# EAGLE design I2C2_6_0 (EAGLE 6.1)
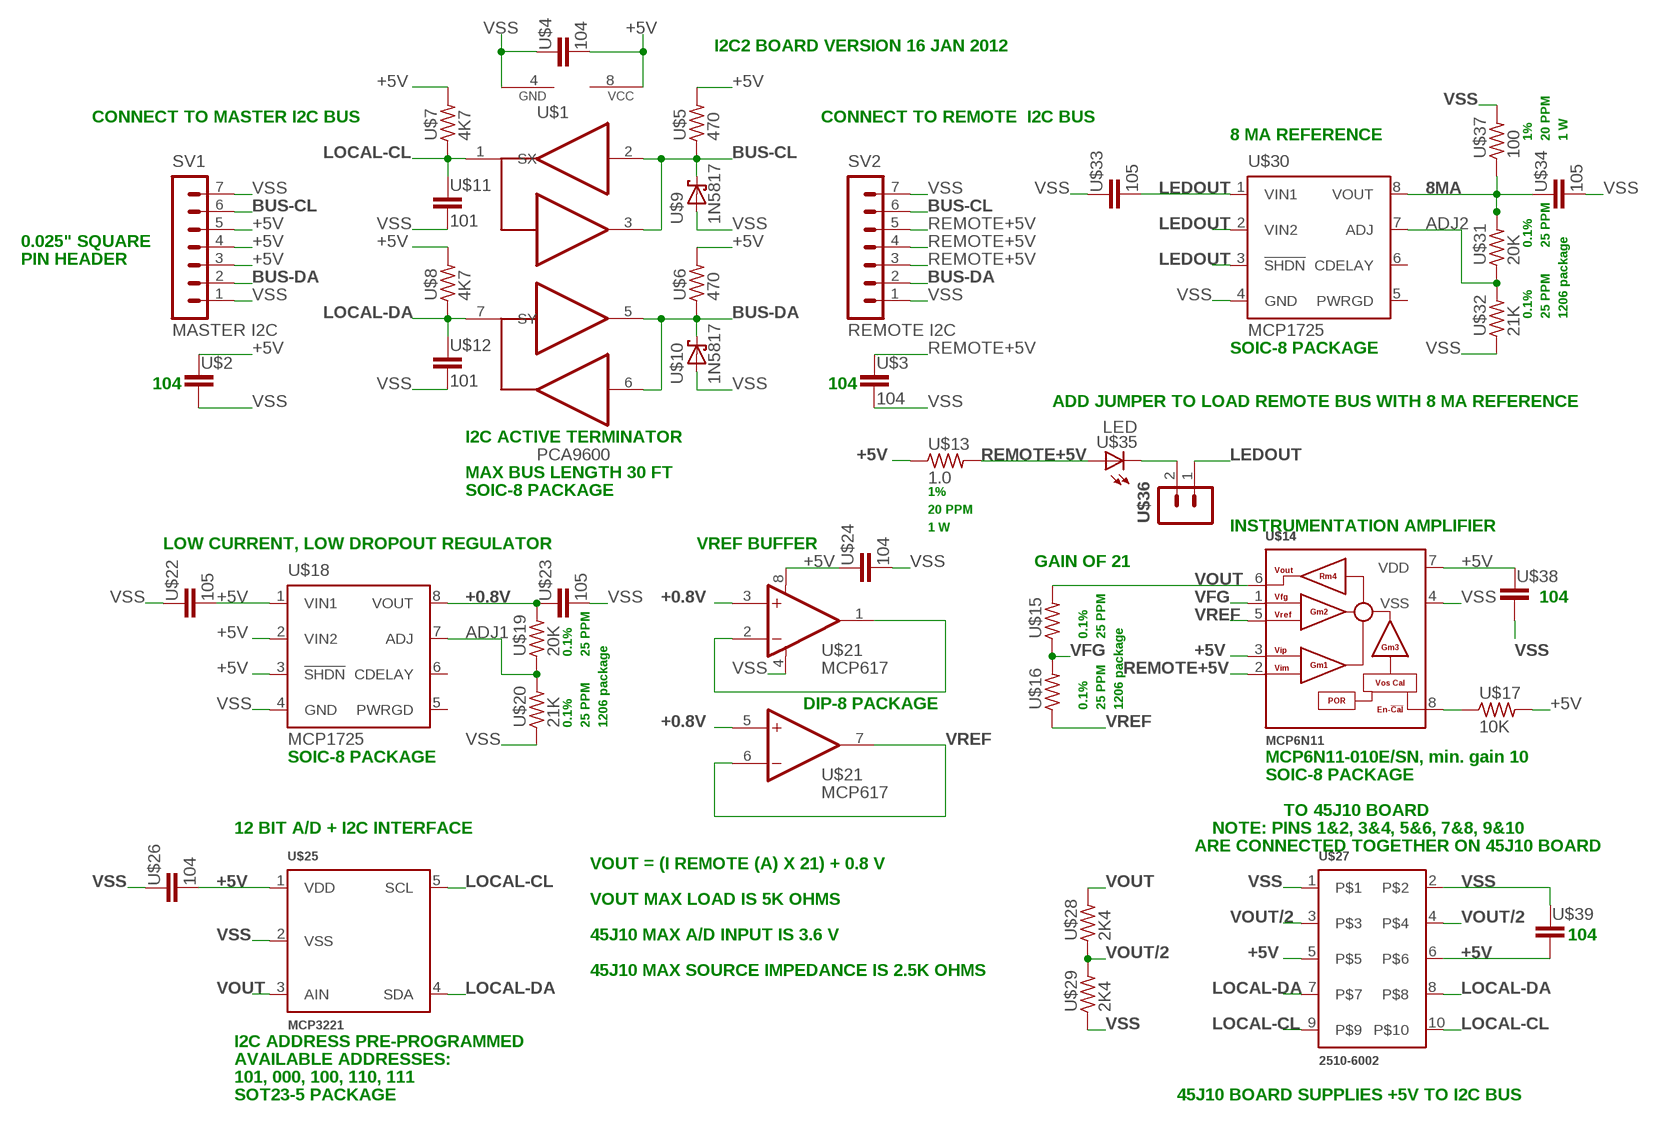
[diagram p0: schematic, sheet 1]

## Parts
SV1  MASTER I2C  MA07-1  [MA07-1]
SV2  REMOTE I2C  MA07-1  [MA07-1]
U$1  PCA9600  PCA9600SO8  [SO08]
U$2  C2.5-5  [C2.5-5]
U$3  104  C2.5-5  [C2.5-5]
U$4  104  C2.5-5  [C2.5-5]
U$5  470  R-1/4W  [R-1/4W]
U$6  470  R-1/4W  [R-1/4W]
U$7  4K7  R-1/4W  [R-1/4W]
U$8  4K7  R-1/4W  [R-1/4W]
U$9  1N5817  1N5817P  [1N5817]
U$10  1N5817  1N5817P  [1N5817]
U$11  101  C2.5-5  [C2.5-5]
U$12  101  C2.5-5  [C2.5-5]
U$13  1.0  R-1W-20PPM  [R-1W]
U$14  MCP6N11  MCP6N11-SO08  [SO08]
U$15  R1206  [R1206]
U$16  R1206  [R1206]
U$17  10K  R-1/4W  [R-1/4W]
U$18  MCP1725  MCP1725-ADJ  [SO08]
U$19  20K  R1206  [R1206]
U$20  21K  R1206  [R1206]
U$21  MCP617  MCP617-I/P  [DIL08]
U$22  105  C2.5-5  [C2.5-5]
U$23  105  C2.5-5  [C2.5-5]
U$24  104  C2.5-5  [C2.5-5]
U$25  MCP3221  [SOT23-5]
U$26  104  C2.5-5  [C2.5-5]
U$27  2510-6002  [2510-6002]
U$28  2K4  R-1/4W  [R-1/4W]
U$29  2K4  R-1/4W  [R-1/4W]
U$30  MCP1725  MCP1725-ADJ  [SO08]
U$31  20K  R1206  [R1206]
U$32  21K  R1206  [R1206]
U$33  105  C2.5-5  [C2.5-5]
U$34  105  C2.5-5  [C2.5-5]
U$35  LED  LED-SMD-1206  [LED1206]
U$36  MA02-1  [MA02-1]
U$37  100  R-1W-20PPM  [R-1W]
U$38  C2.5-5  [C2.5-5]
U$39  C2.5-5  [C2.5-5]

## Nets
8MA: U$30.8(VOUT) U$31.2 U$34.1 U$37.1
+0.8V: U$18.8(VOUT) U$19.2 U$21.3(+IN) U$21.5(+IN1) U$23.1
+5V: SV1.3 SV1.4 SV1.5 U$1.8(VCC) U$2.1 U$4.2 U$5.2 U$6.2 U$7.2 U$8.2 U$13.1 U$14.3(VIP) U$14.7(VDD) U$17.2 U$18.1(VIN1) U$18.2(VIN2) U$18.3(!SHDN) U$21.8(V+) U$22.2 U$24.1 U$25.1(VDD) U$26.2 U$27.5 U$27.6 U$38.1 U$39.2
ADJ1: U$18.7(ADJ) U$19.1 U$20.2
ADJ2: U$30.7(ADJ) U$31.1 U$32.2
BUS-CL: SV1.6 SV2.6 U$1.2(RX) U$1.3(TX) U$5.1 U$9.C
BUS-DA: SV1.2 SV2.2 U$1.5(TY) U$1.6(RY) U$6.1 U$10.C
LEDOUT: U$30.1(VIN1) U$30.2(VIN2) U$30.3(!SHDN) U$33.2 U$36.1
LOCAL-CL: U$1.1(SX) U$7.1 U$11.1 U$25.5(SCL) U$27.9 U$27.10
LOCAL-DA: U$1.7(SY) U$8.1 U$12.1 U$25.4(SDA) U$27.7 U$27.8
N$1: U$35.C U$36.2
N$3: U$14.8(EN) U$17.1
REMOTE+5V: SV2.3 SV2.4 SV2.5 U$3.1 U$13.2 U$14.2(VIM) U$35.A
VFG: U$14.1(VFG) U$15.1 U$16.2
VOUT: U$14.6(VOUT) U$15.2 U$25.3(AIN) U$28.2
VOUT/2: U$27.3 U$27.4 U$28.1 U$29.2
VREF: U$14.5(VREF) U$16.1 U$21.6(-IN1) U$21.7(OUT1)
VREF2: U$21.1(OUT) U$21.2(-IN)
VSS: SV1.1 SV1.7 SV2.1 SV2.7 U$1.4(GND) U$2.2 U$3.2 U$4.1 U$9.A U$10.A U$11.2 U$12.2 U$14.4(VSS) U$18.4(GND) U$20.1 U$21.4(V-) U$22.1 U$23.2 U$24.2 U$25.2(VSS) U$26.1 U$27.1 U$27.2 U$29.1 U$30.4(GND) U$32.1 U$33.1 U$34.2 U$37.2 U$38.2 U$39.1
Unconnected: U$18.5(PWRGD) U$18.6(CDELAY) U$30.5(PWRGD) U$30.6(CDELAY)

## Notes on the sheet
- I2C2 BOARD VERSION 16 JAN 2012
- CONNECT TO MASTER I2C BUS | CONNECT TO REMOTE  I2C BUS
- 8 MA REFERENCE | 1% | 20 PPM | 1 W
- 0.025" SQUARE | 0.1% | 25 PPM
- PIN HEADER
- 0.1% | 25 PPM | 1206 package
- SOIC-8 PACKAGE
- 104 | 104
- ADD JUMPER TO LOAD REMOTE BUS WITH 8 MA REFERENCE
- I2C ACTIVE TERMINATOR
- MAX BUS LENGTH 30 FT
- SOIC-8 PACKAGE | 1%
- 20 PPM
- 1 W | INSTRUMENTATION AMPLIFIER
- LOW CURRENT, LOW DROPOUT REGULATOR | VREF BUFFER
- GAIN OF 21
- 104
- 0.1% | 25 PPM
- 0.1% | 25 PPM
- DIP-8 PACKAGE | 0.1% | 25 PPM | 1206 package
- 0.1% | 25 PPM | 1206 package
- SOIC-8 PACKAGE | MCP6N11-010E/SN, min. gain 10
- SOIC-8 PACKAGE
- TO 45J10 BOARD
- 12 BIT A/D + I2C INTERFACE | NOTE: PINS 1&2, 3&4, 5&6, 7&8, 9&10
- ARE CONNECTED TOGETHER ON 45J10 BOARD
- VOUT = (I REMOTE (A) X 21) + 0.8 V
- VOUT MAX LOAD IS 5K OHMS
- 45J10 MAX A/D INPUT IS 3.6 V | 104
- 45J10 MAX SOURCE IMPEDANCE IS 2.5K OHMS
- I2C ADDRESS PRE-PROGRAMMED
- AVAILABLE ADDRESSES:
- 101, 000, 100, 110, 111
- SOT23-5 PACKAGE | 45J10 BOARD SUPPLIES +5V TO I2C BUS

## Library data of the parts
SV1 SV2 = 4534_I2C2:MA07-1: Male Header 0.040 drill
U$1 = 4534_I2C2:PCA9600: I2C ACTIVE TERMINATOR SO-8
U$2-U$4 U$11 U$12 U$22-U$24 U$26 U$33 U$34 U$38 U$39 = 4534_I2C2:C2.5-5: CAPACITOR, 2.5 MM SPACING
U$5-U$8 U$17 U$28 U$29 = 4534_I2C2:R-1/4W: STANDARD 1/4W 5% RESISTOR
U$9 U$10 = 4534_I2C2:1N5817: Schottky diode
U$13 U$37 = 4534_I2C2:R-1W: Ohmite WNB 1% 1 W resistor
U$14 = 4534_I2C2:MCP6N11: 500 kHz, 800 µA Instrumentation Amplifier
U$15 U$16 U$19 U$20 U$31 U$32 = 4534_I2C2:R1206: Surface mount resistor, 1206 package
U$18 U$30 = 4534_I2C2:MCP1725: 500 mA, Low Voltage, Low Quiescent Current LDO Regulator
U$21 = 4534_I2C2:MCP617: Microchip dual opamp
U$25 = 4534_I2C2:MCP3221: Low Power 12-Bit A/D Converter With I2C Interface
U$27 = 4534_I2C2:2510-6002: 3M 2510-6002 Walled Header
U$35 = 4534_I2C2:LED-SMD-1206: 160-1169-1-ND
U$36 = 4534_I2C2:MA02-1: Male Header 0.040 drill

## Board
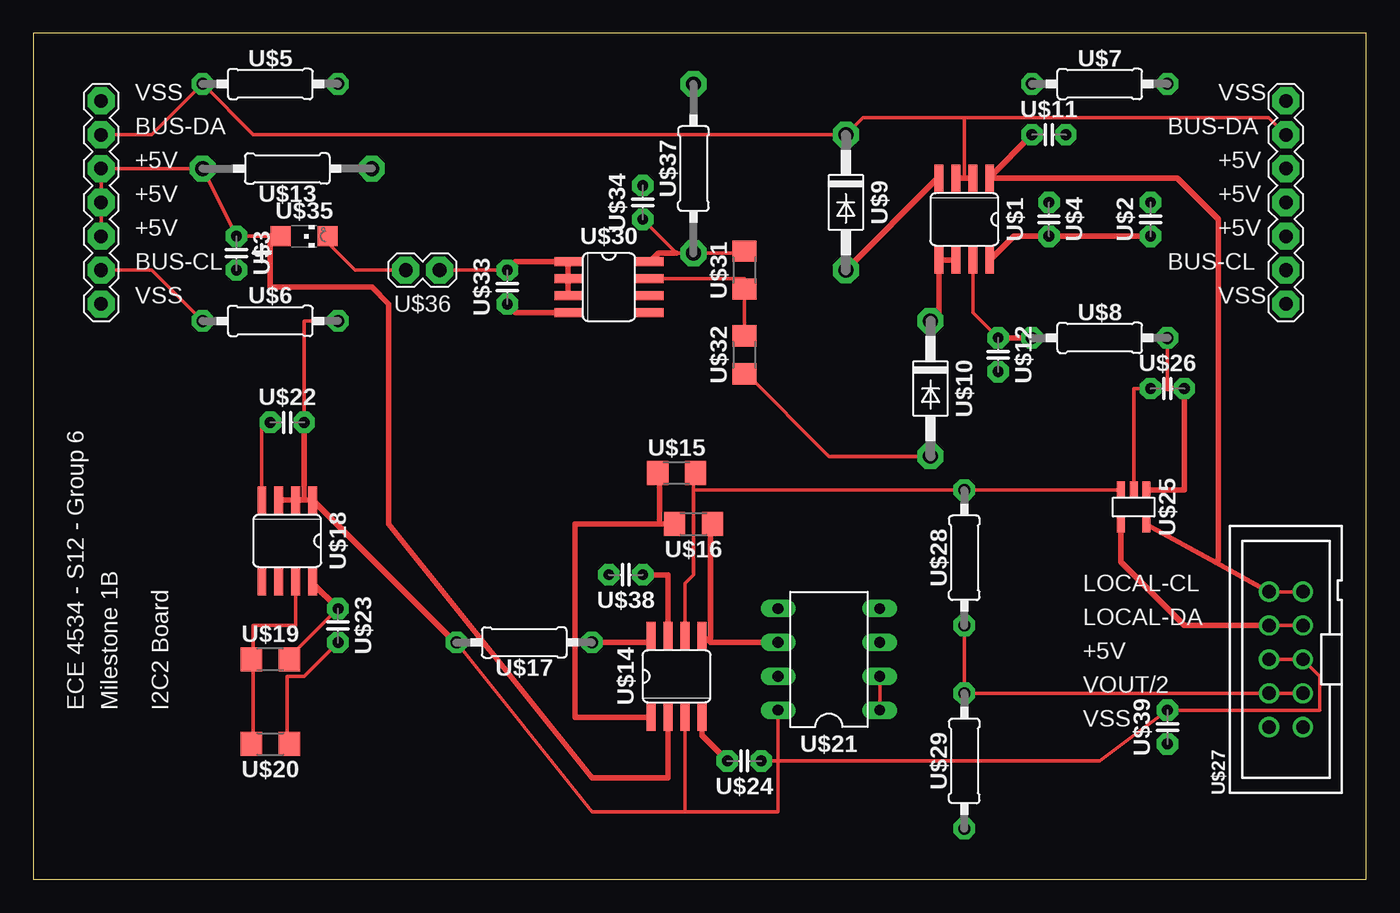
[diagram p1: board, top side]
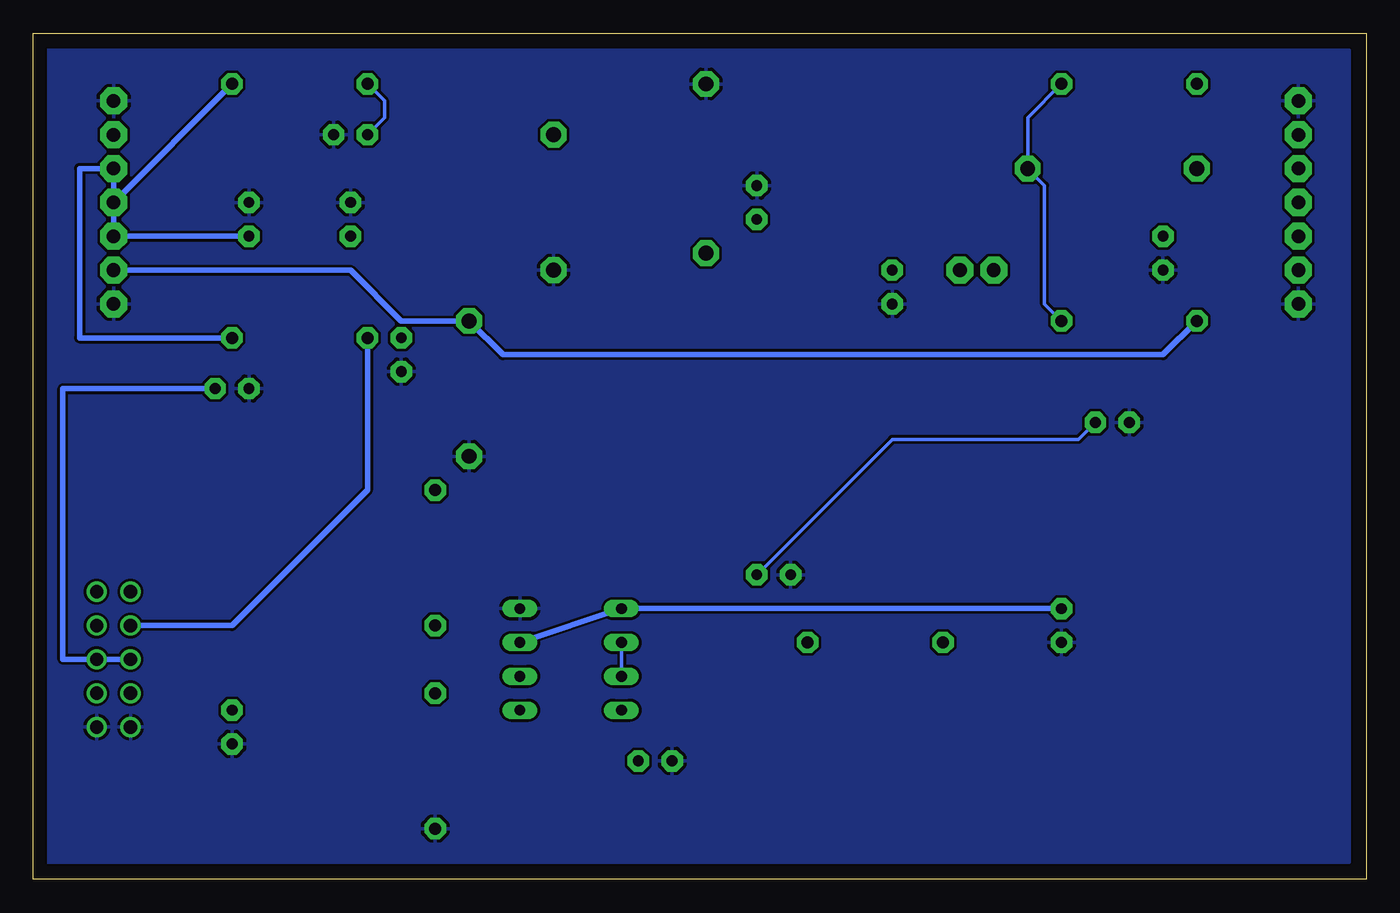
[diagram p2: board, bottom side, seen from below]

Size 100 x 63.49 mm. Coordinates in mm from the lower left corner, seen from the top.
Outline: 0,0 100,0 100,63.49 0,63.49 0,0
Copper layers (1*16): Top 0.035mm / dielectric 1.5mm / Bottom 0.035mm
Design rules: minimum track width 10mil, minimum drill 24mil, track to track 8mil, track to pad 8mil, pad to pad 8mil, via to via 8mil, smd to smd 8mil, copper to edge 40mil, drill to drill 8mil, minimum pad ring 10mil, minimum via ring 8mil, stop-mask expansion 4mil, vias tented up to drill 0mil, thermal gap 10mil
tRestrict: area 41.9,41.9 to 44.5,47; area 67.3,48.3 to 72.4,50.8; area 58.4,11.4 to 61,21.6; area 45.7,14 to 50.8,16.5; area 16.5,24.1 to 21.6,26.7

### Footprints (pad centres in the part's own frame; a part is rotated, then mirrored left to right if it is on the bottom)
MA07-1 = drill 1.016 pad 2.032 octagon: 1 -7.62,0; 2 -5.08,0; 3 -2.54,0; 4 0,0; 5 2.54,0; 6 5.08,0; 7 7.62,0
SO08 = smd 0.66 x 2.032: 1 -1.905,-3.073; 2 -0.635,-3.073; 3 0.635,-3.073; 4 1.905,-3.073; 5 1.905,3.073; 6 0.635,3.073; 7 -0.635,3.073; 8 -1.905,3.073
C2.5-5 = drill 0.813 pad 1.6 octagon: 1 -1.27,0; 2 1.27,0
R-1/4W = drill 0.9 pad 1.6 octagon: 1 -5.08,0; 2 5.08,0
1N5817 = drill 1.118 pad 1.93 octagon: A 5.08,0; C -5.08,0
R-1W = drill 1.118 pad 1.93 octagon: 1 -6.35,0; 2 6.35,0
R1206 = smd 1.6 x 1.803: 1 -1.422,0; 2 1.422,0
DIL08 = drill 0.813 long: 1 -3.81,-3.81; 2 -1.27,-3.81; 3 1.27,-3.81; 4 3.81,-3.81; 5 3.81,3.81; 6 1.27,3.81; 7 -1.27,3.81; 8 -3.81,3.81
SOT23-5 = smd 0.6 x 1.2: 1 -0.95,-1.306; 2 0,-1.306; 3 0.95,-1.306; 4 0.95,1.306; 5 -0.95,1.306
2510-6002 = drill 1 pad 1.422: 1 -5.08,-1.27; 2 -5.08,1.27; 3 -2.54,-1.27; 4 -2.54,1.27; 5 0,-1.27; 6 0,1.27; 7 2.54,-1.27; 8 2.54,1.27; 9 5.08,-1.27; 10 5.08,1.27
LED1206 = smd 1.5 x 1.5: A 0,-1.75; C 0,1.75
MA02-1 = drill 1.016 pad 2.032 octagon: 1 -1.27,0; 2 1.27,0

### Placement (x,y rotation side)
SV1  93.98,50.8 90 top
SV2  5.08,50.8 90 top
U$1  69.85,49.53 180 top
U$2  83.82,49.53 90 top
U$3  15.24,46.99 270 top
U$4  76.2,49.53 270 top
U$5  17.78,59.69 0 top
U$6  17.78,41.91 0 top
U$7  80.01,59.69 0 top
U$8  80.01,40.64 0 top
U$9  60.96,50.8 270 top
U$10  67.31,36.83 270 top
U$11  76.2,55.88 0 top
U$12  72.39,39.37 270 top
U$13  19.05,53.34 180 top
U$14  48.26,15.24 0 top
U$15  48.26,30.48 0 top
U$16  49.53,26.67 180 top
U$17  36.83,17.78 180 top
U$18  19.05,25.4 180 top
U$19  17.78,16.51 0 top
U$20  17.78,10.16 180 top
U$21  59.69,16.51 90 top
U$22  19.05,34.29 0 top
U$23  22.86,19.05 270 top
U$24  53.34,8.89 180 top
U$25  82.55,27.94 180 top
U$26  85.09,36.83 0 top
U$27  93.98,16.51 90 top
U$28  69.85,24.13 90 top
U$29  69.85,8.89 90 top
U$30  43.18,44.45 270 top
U$31  53.34,45.72 90 top
U$32  53.34,39.37 90 top
U$33  35.56,44.45 90 top
U$34  45.72,50.8 90 top
U$35  20.32,48.26 270 top
U$36  29.21,45.72 180 top
U$37  49.53,53.34 90 top
U$38  44.45,22.86 180 top
U$39  85.09,11.43 90 top

### Tracks (layer width: path | path; a pad name or v marks a point on that pad's centre or on a via)
8MA
  Top 0.254: U$31.2 53.34,46.99 U$37.1 48.26,46.99 U$34.1
  Top 0.406: 48.26,46.99 46.89,46.99 U$30.8
+0.8V
  Top 0.254: U$23.1 19.05,16.51 U$19.2
  Top 0.406: U$18.8 20.95,22.22 U$23.1
  Bottom 0.406: U$23.1 U$21.5 U$21.3
+5V
  Top 0.254: U$27.6 U$27.5 96.52,15.24 96.52,12.7 U$39.2 80.01,8.89 55.88,8.89 | 55.88,8.89 55.88,5.08 48.9,5.08 | 55.88,8.89 U$21.8 | U$24.1 55.88,8.89 | U$17.2 41.91,5.08 48.9,5.08 | 85.09,36.83 U$8.2 | U$22.2 20.32,41.91 U$6.2 | U$14.3 48.9,5.08
  Top 0.406: 85.09,36.83 U$26.2 86.36,29.21 83.5,29.21 U$25.1 | U$18.3 U$18.2 U$18.1 | U$18.1 20.32,28.47 U$22.2 | U$1.8 73.56,48.26 U$4.2 U$2.1 | U$17.2 31.65,17.78 U$18.1 | U$38.1 47.62,22.86 U$14.7
  Bottom 0.254: U$5.2 25.4,57.15 U$13.1 24.13,52.07 24.13,43.18 U$6.2 | U$38.1 35.56,33.02 21.59,33.02 U$22.2
  Bottom 0.406: U$7.2 SV1.4 | U$8.2 96.52,40.64 96.52,53.34 SV1.5 SV1.4 | SV1.4 SV1.3 U$2.1 | U$27.6 97.79,16.51 97.79,36.83 U$26.2
ADJ1
  Top 0.254: 16.51,16.51 16.51,10.16 U$20.2 | 16.51,16.51 U$19.1 | U$18.7 19.68,19.05 16.51,19.05 16.51,16.51
ADJ2
  Top 0.254: 53.34,40.64 U$32.2 U$31.1 53.34,45.08 U$30.7
BUS-CL
  Top 0.254: SV2.6 8.89,55.88 U$5.1 16.51,55.88 U$9.C 62.23,57.15 69.85,57.15 | 69.85,57.15 92.71,57.15 SV1.6 | U$1.3 69.85,52.6 69.85,57.15
  Top 0.406: U$1.2 U$1.3
BUS-DA
  Top 0.254: U$6.1 8.89,45.72 SV2.2
  Top 0.406: U$1.6 U$1.5 67.94,42.55 U$10.C
  Bottom 0.406: U$6.1 15.24,39.37 64.77,39.37 U$10.C 72.39,41.91 76.2,45.72 SV1.2
LEDOUT
  Top 0.254: U$36.1 U$33.2
  Top 0.406: U$30.3 U$30.2 U$30.1 36.2,46.36 U$33.2
LOCAL-CL
  Top 0.254: U$27.9 U$27.10
  Top 0.406: U$25.5 88.71,23.78 | 88.71,23.78 U$27.10 | U$11.1 71.75,52.7 U$1.1 85.83,52.6 88.9,49.53 88.9,23.97 88.71,23.78
  Bottom 0.254: U$11.1 73.66,57.15 73.66,58.42 U$7.1
LOCAL-DA
  Top 0.254: U$27.7 U$27.8 | U$1.7 70.48,42.55 U$12.1
  Top 0.406: U$12.1 U$8.1 | U$25.4 81.6,23.81 86.36,19.05 U$27.8
  Bottom 0.406: U$8.1 74.93,29.21 85.09,19.05 U$27.8
N$1
  Top 0.254: U$36.2 24.13,45.72 21.59,48.26 U$35.C
N$3
  Top 0.406: U$17.1 46.35,17.78 U$14.8
REMOTE+5V
  Top 0.254: SV2.3 SV2.4 SV2.5 U$13.2 U$3.1 17.78,48.26 U$35.A 19.05,48.26
  Top 0.406: U$14.2 47.62,7.62 41.91,7.62 26.67,26.67 26.67,43.18 25.4,44.45 17.78,44.45 17.78,48.26
VFG
  Top 0.406: U$15.1 46.99,30.48 46.99,26.67 U$16.2 40.64,26.67 40.64,12.17 U$14.1
VOUT
  Top 0.254: 49.53,29.21 49.53,30.48 | 49.53,29.21 U$28.2 81.6,29.21 U$25.3 | 48.9,19.05 48.9,22.22 49.53,22.86 49.53,29.21
  Top 0.406: U$15.2 49.53,30.48 | 48.9,19.05 U$14.6
VOUT/2
  Top 0.254: U$27.3 U$27.4 U$29.2 U$28.1
VREF
  Top 0.406: U$21.6 50.8,17.78 | U$14.5 50.8,17.78 | U$16.1 50.8,26.67 50.8,17.78
  Bottom 0.254: U$21.6 U$21.7
VREF2
  Top 0.254: U$21.2 U$21.1
VSS
  Top 0.254: U$26.1 82.55,36.83 U$25.2 82.55,29.21 | U$23.2 20.32,15.24 19.05,15.24 19.05,10.16 U$20.1 | U$10.A 59.69,31.75 53.34,38.1 U$32.1 | U$18.4 17.14,34.29 U$22.1
  Top 0.406: U$14.4 50.16,10.79 U$24.2 | U$30.4 36.2,42.55 U$33.1 | U$1.4 67.84,52.6 U$9.A
  pour Bottom: 1.27,62.23 99.06,62.23 99.06,1.27 1.27,1.27

### Text on the board
_tsilk: VSS | VSS | BUS-DA | BUS-DA | +5V | +5V | +5V | +5V | +5V | +5V | BUS-CL | BUS-CL | VSS | VSS | LOCAL-CL | LOCAL-DA | +5V | VOUT/2 | ECE 4534 - S12 - Group 6 | Milestone 1B | I2C2 Board | VSS